# EAGLE design mach loa nghe nhac (EAGLE 5.07)
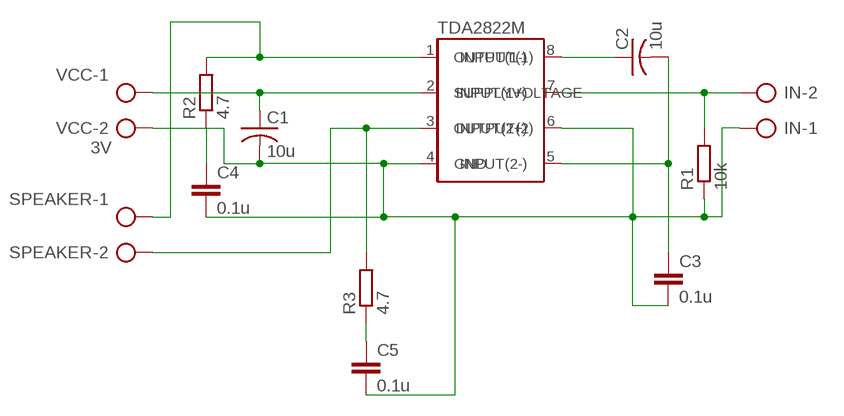
[diagram p0: schematic, sheet 1]

## Parts
C1  10u  C-US025-025X050  [C025-025X050]
C2  10u  C-US025-025X050  [C025-025X050]
C3  0.1u  C-EU025-030X050  [C025-030X050]
C4  0.1u  C-EU025-030X050  [C025-030X050]
C5  0.1u  C-EU025-030X050  [C025-030X050]
IN  AK500/2-H  [AK500/2-H]
R1  10k  R-EU_0207/10  [0207/10]
R2  4.7  R-EU_0207/10  [0207/10]
R3  4.7  R-EU_0207/10  [0207/10]
SPEAKER  AK500/2-H  [AK500/2-H]
U$1  TDA2822M  [MINIDIP]
VCC  3V  AK500/2-H  [AK500/2-H]

## Nets
N$1: R2.2 SPEAKER.1 U$1.1(OUTPUT(1))
N$2: IN.2 R1.2 U$1.7(INPUT(1+))
N$3: C1.1 U$1.2(SUPPLYVOLTAGE) VCC.1
N$4: C2.1 U$1.8(INPUT(1-))
N$5: C4.1 R2.1
N$6: C1.2 C3.2 C4.2 C5.2 IN.1 R1.1 U$1.4(GND) U$1.6(INPUT(2+)) VCC.2
N$7: C2.2 C3.1 U$1.5(INPUT(2-))
N$8: C5.1 R3.1
N$9: R3.2 SPEAKER.2 U$1.3(OUTPUT(2))

## Library data of the parts
C1 C2 = rcl:C-US: CAPACITOR, American symbol
C3-C5 = rcl:C-EU: CAPACITOR, European symbol
IN SPEAKER VCC = con-ptr500:AK500/2-H: CONNECTOR Aug. 2004 / PTR Meßtechnik: Die Bezeichnung der Serie AK505 wurde geändert. Es handelt sich hierbei um AK500 in horizontaler Ausführung.
R1-R3 = resistor:R-EU_: RESISTOR, European symbol
U$1 = Nhut:TDA2822M

## Net classes
0 default: width 2 mm

## Board
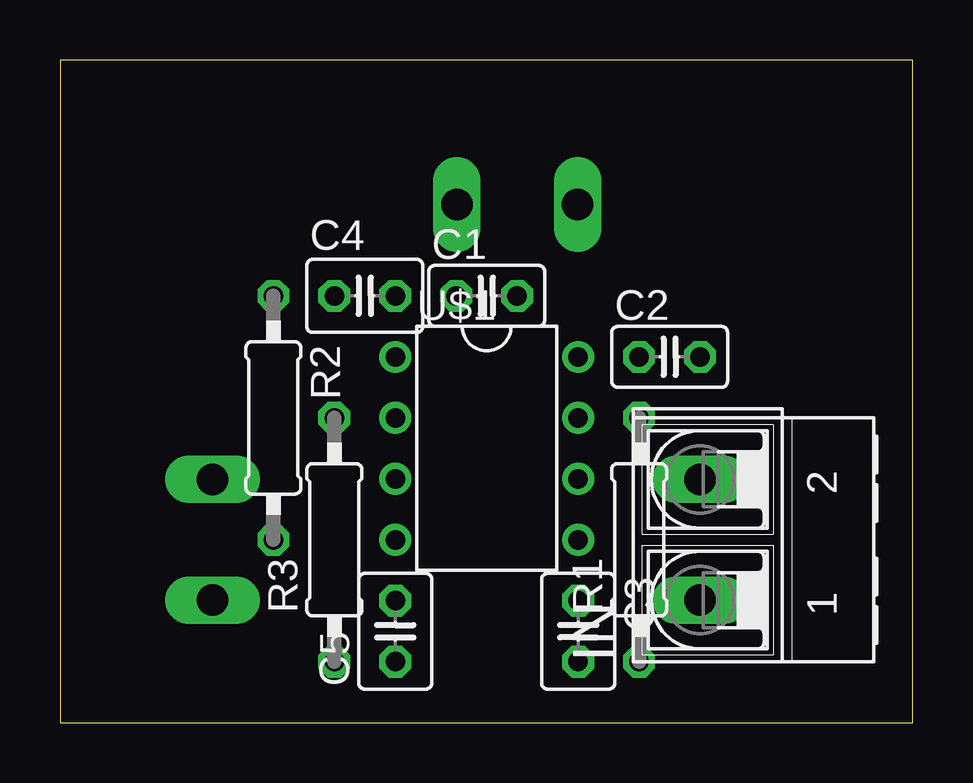
[diagram p1: board, top side]
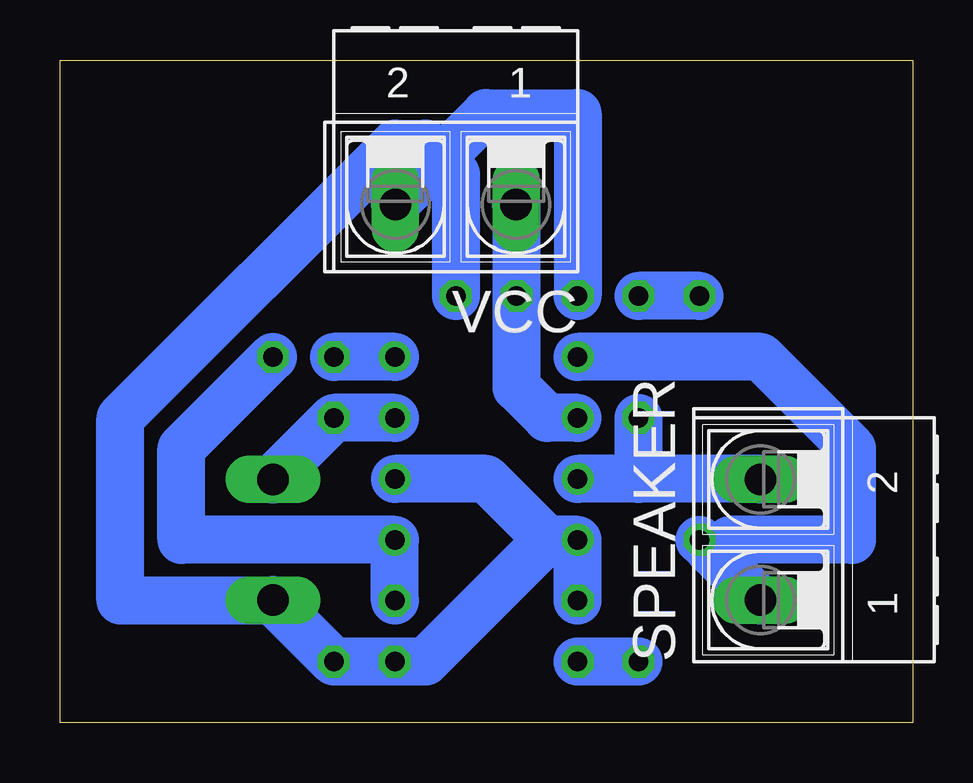
[diagram p2: board, bottom side, seen from below]

Size 35.54 x 27.61 mm. Coordinates in mm from the lower left corner, seen from the top.
Outline: 0,0 35.54,0 35.54,27.61 0,27.61 0,0
Copper layers (1*16): Top 0.035mm / dielectric 1.5mm / Bottom 0.035mm
Design rules "default": minimum track width 10mil, minimum drill 24mil, track to track 8mil, track to pad 8mil, pad to pad 8mil, via to via 8mil, smd to smd 8mil, copper to edge 40mil, drill to drill 8mil, minimum pad ring 10mil, minimum via ring 8mil, stop-mask expansion 4mil, vias tented up to drill 0mil, thermal gap 10mil

### Footprints (pad centres in the part's own frame; a part is rotated, then mirrored left to right if it is on the bottom)
C025-025X050 = drill 0.813 octagon: 1 -1.27,0; 2 1.27,0
C025-030X050 = drill 0.813 octagon: 1 -1.27,0; 2 1.27,0
AK500/2-H = drill 1.321 long: 1 -2.515,0; 2 2.515,0
0207/10 = drill 0.813 octagon: 1 -5.08,0; 2 5.08,0
MINIDIP = drill 0.813 pad 1.27 round: 1 -21.59,-1.27; 2 -19.05,-1.27; 3 -16.51,-1.27; 4 -13.97,-1.27; 5 -13.97,6.35; 6 -16.51,6.35; 7 -19.05,6.35; 8 -21.59,6.35

### Placement (x,y rotation side)
C1  17.78,17.78 0 top
C2  25.4,15.24 0 top
C3  21.59,3.81 270 top
C4  12.7,17.78 0 top
C5  13.97,3.81 90 top
IN  26.67,7.62 90 top
R1  24.13,7.62 90 top
R2  8.89,12.7 270 top
R3  11.43,7.62 90 top
SPEAKER  6.35,7.62 90 bottom
U$1  15.24,-6.35 270 top
VCC  19.05,21.59 180 bottom

### Tracks (layer width: path | path; a pad name or v marks a point on that pad's centre or on a via)
N$1
  Bottom 2: 8.25,6.98 6.35,5.08 SPEAKER.1 | 8.25,6.98 R2.2 | U$1.1 6.35,15.24 2.54,11.43 2.54,7.62 7.62,7.62 8.25,6.98
N$2
  Bottom 2: U$1.7 R1.2 26.67,10.16 IN.2
N$3
  Bottom 2: U$1.2 15.24,12.7 16.51,13.97 C1.1 16.51,21.59 VCC.1
N$4
  Bottom 2: U$1.8 C2.1
N$5
  Bottom 2: R2.1 C4.1
N$6
  Bottom 2: C4.2 13.97,25.4 17.78,25.4 19.69,23.49 | 19.69,23.49 21.59,21.59 VCC.2 | C1.2 19.05,22.86 19.69,23.49 | 26.67,5.08 R1.1 C3.2 20.32,2.54 15.24,7.62 | C5.2 U$1.4 15.24,7.62 | U$1.6 17.78,10.16 15.24,7.62 | 26.67,5.08 33.02,5.08 33.02,12.7 21.59,24.13 20.32,24.13 19.69,23.49 | 26.67,5.08 IN.1
N$7
  Bottom 2: C3.1 U$1.5 30.48,7.62 30.48,11.43 C2.2
N$8
  Bottom 2: R3.1 C5.1
N$9
  Bottom 2: 11.43,10.16 6.35,10.16 SPEAKER.2 | 11.43,10.16 U$1.3 | 11.43,10.16 R3.2